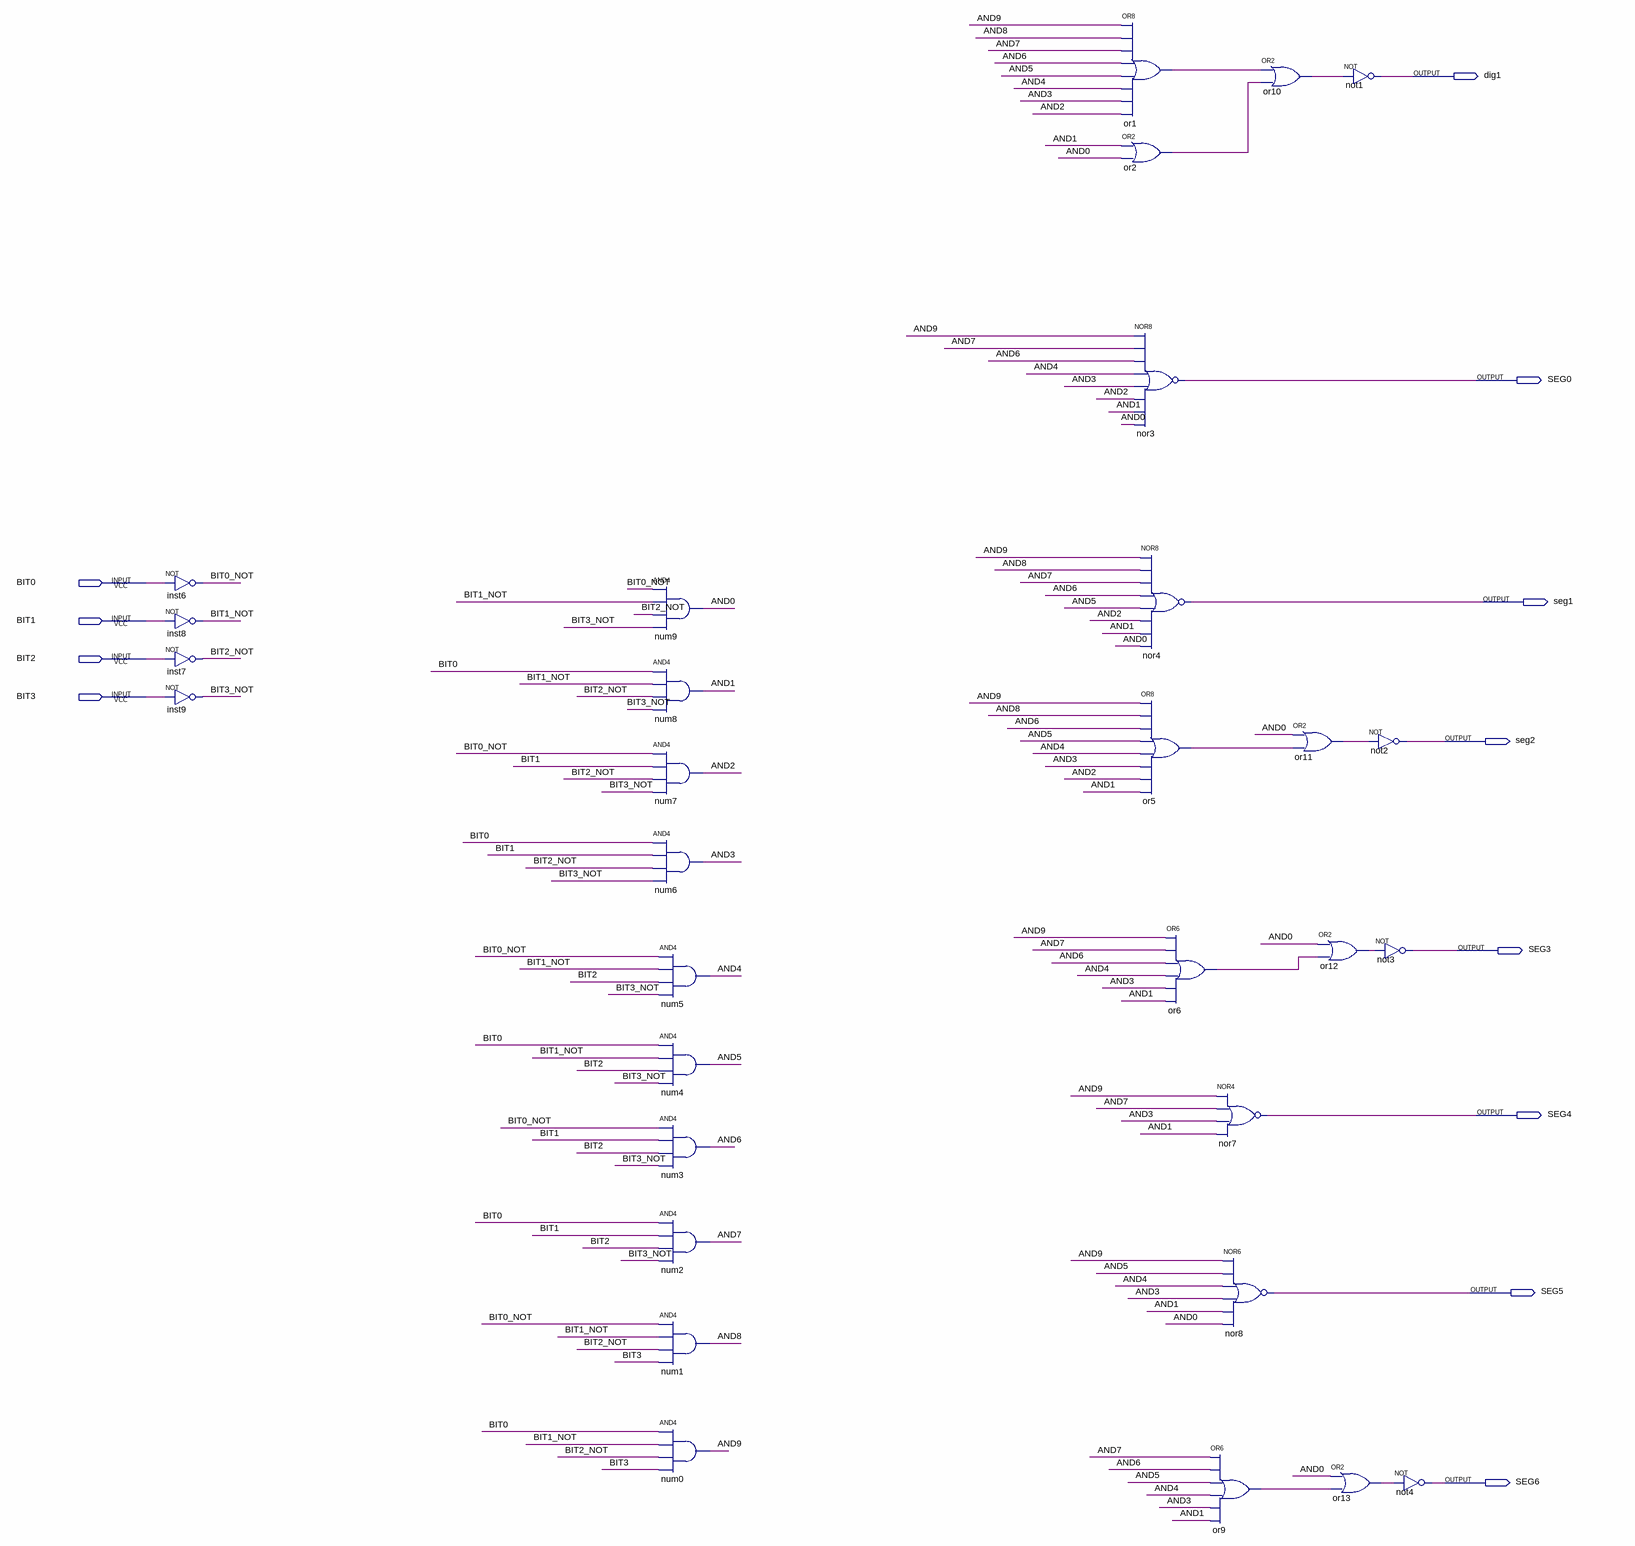
[diagram p0: schematic sheet]
// Quartus schematic d7seg.bdf as structural Verilog: 31 symbols, 12 pins
module d7seg (
  input  BIT0,
  input  BIT1,
  input  BIT2,
  input  BIT3,
  output dig1,
  output SEG0,
  output seg1,
  output seg2,
  output SEG3,
  output SEG4,
  output SEG5,
  output SEG6
);

  wire AND0, AND1, AND2, AND3, AND4, AND5, AND6, AND7, AND8, AND9, BIT0_NOT, BIT1_NOT, BIT2_NOT, BIT3_NOT,
       or1_out, or2_out, or5_out, or6_out, or9_out, or10_out, or11_out, or12_out, or13_out;

  not inst6 (BIT0_NOT, BIT0);
  not inst8 (BIT1_NOT, BIT1);
  not inst7 (BIT2_NOT, BIT2);
  not inst9 (BIT3_NOT, BIT3);
  and num9 (AND0, BIT0_NOT, BIT1_NOT, BIT2_NOT, BIT3_NOT);
  and num8 (AND1, BIT0, BIT1_NOT, BIT2_NOT, BIT3_NOT);
  and num7 (AND2, BIT0_NOT, BIT1, BIT2_NOT, BIT3_NOT);
  and num6 (AND3, BIT0, BIT1, BIT2_NOT, BIT3_NOT);
  and num5 (AND4, BIT0_NOT, BIT1_NOT, BIT2, BIT3_NOT);
  and num4 (AND5, BIT0, BIT1_NOT, BIT2, BIT3_NOT);
  and num3 (AND6, BIT0_NOT, BIT1, BIT2, BIT3_NOT);
  and num2 (AND7, BIT0, BIT1, BIT2, BIT3_NOT);
  and num1 (AND8, BIT0_NOT, BIT1_NOT, BIT2_NOT, BIT3);
  and num0 (AND9, BIT0, BIT1_NOT, BIT2_NOT, BIT3);
  or or1 (or1_out, AND9, AND8, AND7, AND6, AND5, AND4, AND3, AND2);
  or or2 (or2_out, AND1, AND0);
  nor nor3 (SEG0, AND9, AND7, AND6, AND4, AND3, AND2, AND1, AND0);
  nor nor4 (seg1, AND9, AND8, AND7, AND6, AND5, AND2, AND1, AND0);
  or or5 (or5_out, AND9, AND8, AND6, AND5, AND4, AND3, AND2, AND1);
  or or6 (or6_out, AND9, AND7, AND6, AND4, AND3, AND1);
  nor nor7 (SEG4, AND9, AND7, AND3, AND1);
  nor nor8 (SEG5, AND9, AND5, AND4, AND3, AND1, AND0);
  or or9 (or9_out, AND7, AND6, AND5, AND4, AND3, AND1);
  or or10 (or10_out, or1_out, or2_out);
  or or11 (or11_out, AND0, or5_out);
  not not1 (dig1, or10_out);
  or or12 (or12_out, AND0, or6_out);
  or or13 (or13_out, AND0, or9_out);
  not not2 (seg2, or11_out);
  not not3 (SEG3, or12_out);
  not not4 (SEG6, or13_out);
endmodule
